# EAGLE schematic Line Follower (EAGLE 7.7.0)
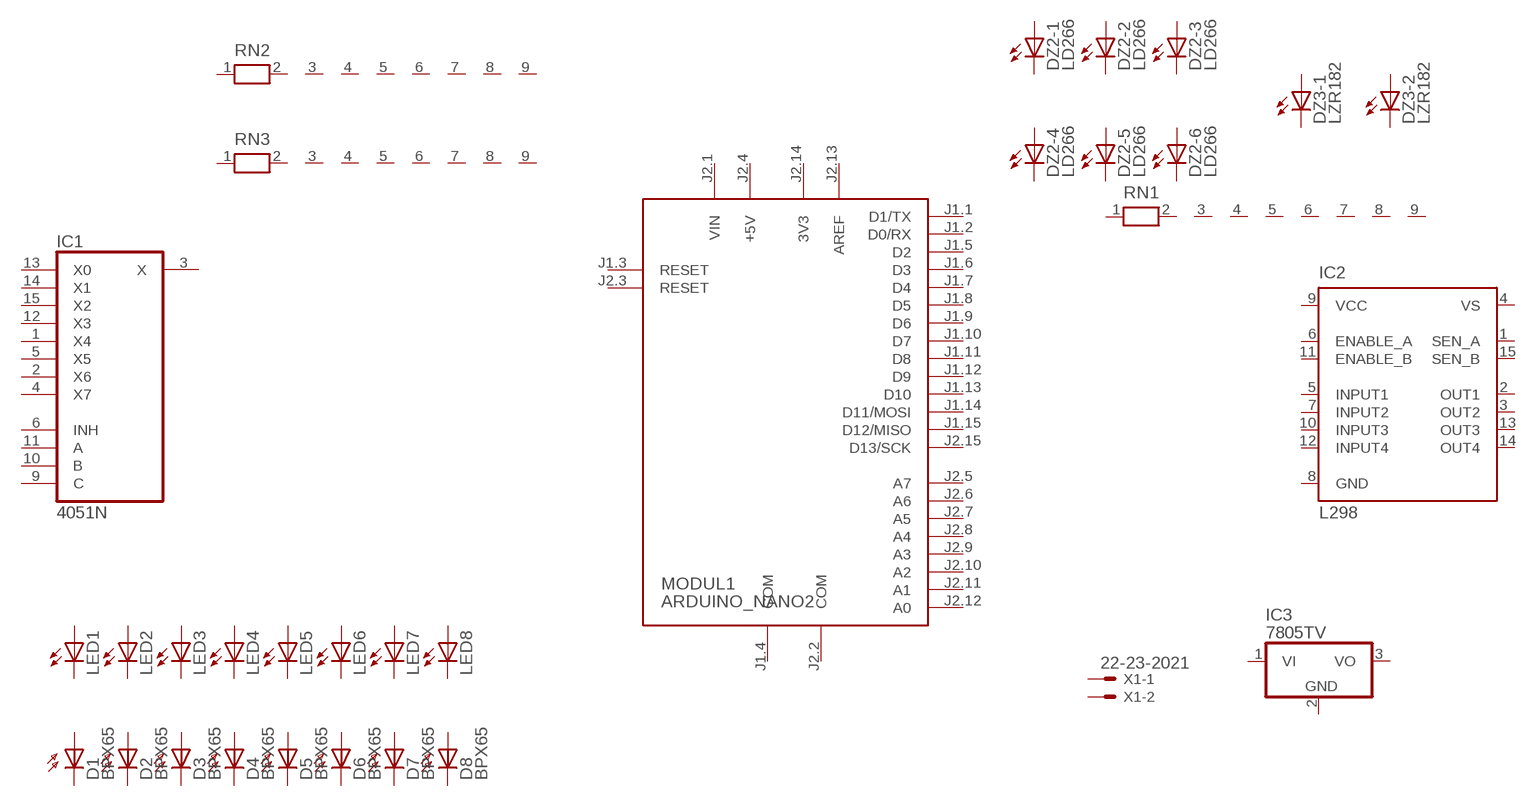
[diagram p0: schematic, sheet 1]

## Parts
D1  BPX65  [BPX65]
D2  BPX65  [BPX65]
D3  BPX65  [BPX65]
D4  BPX65  [BPX65]
D5  BPX65  [BPX65]
D6  BPX65  [BPX65]
D7  BPX65  [BPX65]
D8  BPX65  [BPX65]
DZ2  LD266  [LD266]
DZ3  LZR182  [LZR182]
IC1  4051N  [DIL16]
IC2  L298  [MULTIWATT-15]
IC3  7805TV  [TO220V]
LED1  LED3MM  [LED3MM]
LED2  LED3MM  [LED3MM]
LED3  LED3MM  [LED3MM]
LED4  LED3MM  [LED3MM]
LED5  LED3MM  [LED3MM]
LED6  LED3MM  [LED3MM]
LED7  LED3MM  [LED3MM]
LED8  LED3MM  [LED3MM]
MODUL1  ARDUINO_NANO2  [ARDUINO_NANO2]
RN1  RN08  [RN-9]
RN2  RN08  [RN-9]
RN3  RN08  [RN-9]
X1  22-23-2021  [22-23-2021]
Unconnected: D1.A D1.K(C) D2.A D2.K(C) D3.A D3.K(C) D4.A D4.K(C) D5.A D5.K(C) D6.A D6.K(C) D7.A D7.K(C) D8.A D8.K(C) DZ2.A1(-1:A) DZ2.A2(-2:A) DZ2.A3(-3:A) DZ2.A4(-4:A) DZ2.A5(-5:A) DZ2.A6(-6:A) DZ2.K1(-1:C) DZ2.K2(-2:C) DZ2.K3(-3:C) DZ2.K4(-4:C) DZ2.K5(-5:C) DZ2.K6(-6:C) DZ3.A1(-1:A) DZ3.A2(-2:A) DZ3.K1(-1:C) DZ3.K2(-2:C) IC1.1(X4) IC1.2(X6) IC1.3(X) IC1.4(X7) IC1.5(X5) IC1.6(INH) IC1.9(C) IC1.10(B) IC1.11(A) IC1.12(X3) IC1.13(X0) IC1.14(X1) IC1.15(X2) IC2.1(SEN_A) IC2.2(OUT1) IC2.3(OUT2) IC2.5(INPUT1) IC2.6(ENABLE_A) IC2.7(INPUT2) IC2.10(INPUT3) IC2.11(ENABLE_B) IC2.12(INPUT4) IC2.13(OUT3) IC2.14(OUT4) IC2.15(SEN_B) IC3.1(VI) IC3.2(GND) IC3.3(VO) LED1.A LED1.K(C) LED2.A LED2.K(C) LED3.A LED3.K(C) LED4.A LED4.K(C) LED5.A LED5.K(C) LED6.A LED6.K(C) LED7.A LED7.K(C) LED8.A LED8.K(C) MODUL1.J1.1(D1/TX) MODUL1.J1.2(D0/RX) MODUL1.J1.3(RESET) MODUL1.J1.5(D2) MODUL1.J1.6(D3) MODUL1.J1.7(D4) MODUL1.J1.8(D5) MODUL1.J1.9(D6) MODUL1.J1.10(D7) MODUL1.J1.11(D8) MODUL1.J1.12(D9) MODUL1.J1.13(D10) MODUL1.J1.14(D11/MOSI) MODUL1.J1.15(D12/MISO) MODUL1.J2.3(RESET) MODUL1.J2.5(A7) MODUL1.J2.6(A6) MODUL1.J2.7(A5) MODUL1.J2.8(A4) MODUL1.J2.9(A3) MODUL1.J2.10(A2) MODUL1.J2.11(A1) MODUL1.J2.12(A0) MODUL1.J2.15(D13/SCK) RN1.1 RN1.2 RN1.3 RN1.4 RN1.5 RN1.6 RN1.7 RN1.8 RN1.9 RN2.1 RN2.2 RN2.3 RN2.4 RN2.5 RN2.6 RN2.7 RN2.8 RN2.9 RN3.1 RN3.2 RN3.3 RN3.4 RN3.5 RN3.6 RN3.7 RN3.8 RN3.9 X1.1 X1.2

## Power pins joined to a net without a drawn wire
3V3: MODUL1.J2.14(3V3)
+5V: MODUL1.J2.4(+5V)
AREF: MODUL1.J2.13(AREF)
COM: MODUL1.J1.4(COM) MODUL1.J2.2(COM)
GND: IC1.8(GND) IC2.8(GND)
VCC: IC1.16(VCC) IC2.9(VCC)
VEE: IC1.7(VEE)
VIN: MODUL1.J2.1(VIN)
VS: IC2.4(VS)

## Library data of the parts
D1-D8 = opto-trans-siemens:BPX65: PHOTO DIODE; MPN: BPX65.; OC_FARNELL: 327451; OC_NEWARK: 06WX2764
DZ2 = led:LD266: LED BLOCK 6 LEDs, Siemens
DZ3 = led:LZR182: LED BLOCK 2 LEDs, Siemens
IC1 = 40xx:4051: 8-channel ANALOG MULTIPLEXER
IC2 = st-microelectronics:L298: DUAL FULL-BRIDGE DRIVER; MPN: L298N; OC_FARNELL: 1589425; OC_NEWARK: 32M1527
IC3 = linear:78*: Positive VOLTAGE REGULATOR Source: http://cache.national.com/ds/LM/LM78L05.pdf http://www.fairchildsemi.com/ds/LM/LM7805.pdf
LED1-LED8 = led:LED: LED OSRAM: - CHIPLED LG R971, LG N971, LY N971, LG Q971, LY Q971, LO R971, LY R971 LH N974, LH R974 LS Q976, LO Q976, LY Q976 LO Q996 - Hyper CHIPLED LW Q18S LB Q993, LB Q99A, LB R99A - SideLED LS A670, LO A670, LY A670, LG A670, LP A670 LB A673, LV A673, LT A673, LW A673 LH A674 LY A675 LS A676, LA A676, LO A676, LY A676, LW A676 LS A679, LY A679, LG A679 - Hyper Micro SIDELED® LS Y876, LA Y876, LO Y876, LY Y876 LT Y87S - SmartLED LW L88C, LW L88S LB L89C, LB L89S, LG L890 LS L89K, LO L89K, LY L89K LS L896, LA L896, LO L896, LY L896 - TOPLED LS T670, LO T670, LY T670, LG T670, LP T670 LSG T670, LSP T670, LSY T670, LOP T670, LYG T670 LG T671, LOG T671, LSG T671 LB T673, LV T673, LT T673, LW T673 LH T674 LS T676, LA T676, LO T676, LY T676, LB T676, LH T676, LSB T676, LW T676 LB T67C, LV T67C, LT T67C, LS T67K, LO T67K, LY T67K, LW E67C LS E67B, LA E67B, LO E67B, LY E67B, LB E67C, LV E67C, LT E67C LW T67C LS T679, LY T679, LG T679 LS T770, LO T770, LY T770, LG T770, LP T770 LB T773, LV T773, LT T773, LW T773 LH T774 LS E675, LA E675, LY E675, LS T675 LS T776, LA T776, LO T776, LY T776, LB T776 LHGB T686 LT T68C, LB T68C - Hyper Mini TOPLED® LB M676 - Mini TOPLED Santana® LG M470 LS M47K, LO M47K, LY M47K Source: http://www.osram.convergy.de LUXEON: - LUMILED® LXK2-PW12-R00, LXK2-PW12-S00, LXK2-PW14-U00, LXK2-PW14-V00 LXK2-PM12-R00, LXK2-PM12-S00, LXK2-PM14-U00 LXK2-PE12-Q00, LXK2-PE12-R00, LXK2-PE12-S00, LXK2-PE14-T00, LXK2-PE14-U00 LXK2-PB12-K00, LXK2-PB12-L00, LXK2-PB12-M00, LXK2-PB14-N00, LXK2-PB14-P00, LXK2-PB14-Q00 LXK2-PR12-L00, LXK2-PR12-M00, LXK2-PR14-Q00, LXK2-PR14-R00 LXK2-PD12-Q00, LXK2-PD12-R00, LXK2-PD12-S00 LXK2-PH12-R00, LXK2-PH12-S00 LXK2-PL12-P00, LXK2-PL12-Q00, LXK2-PL12-R00 Source: www.luxeon.com KINGBRIGHT: KA-3528ASYC Source: www.kingbright.com
MODUL1 = arduino2:ARDUINO_NANO2: Arduino Nano2 Auto generated by modulcreator.ulp \;; ANZAHL: 2; MODUL: TRUE; STECKX0: -76200; STECKX1: 76200; STECKY0: 177800; STECKY1: 177800
RN1-RN3 = resistor-net:RN08: RESISTOR NETWORK; OC_FARNELL: unknown; OC_NEWARK: unknown
X1 = con-molex:22-23-2021: .100" (2.54mm) Center Header - 2 Pin; MF: MOLEX; MPN: 22-23-2021; OC_FARNELL: 1462926; OC_NEWARK: 25C3832